# Altium schematic sheet [00] Block Diagram.SchDoc
size A4
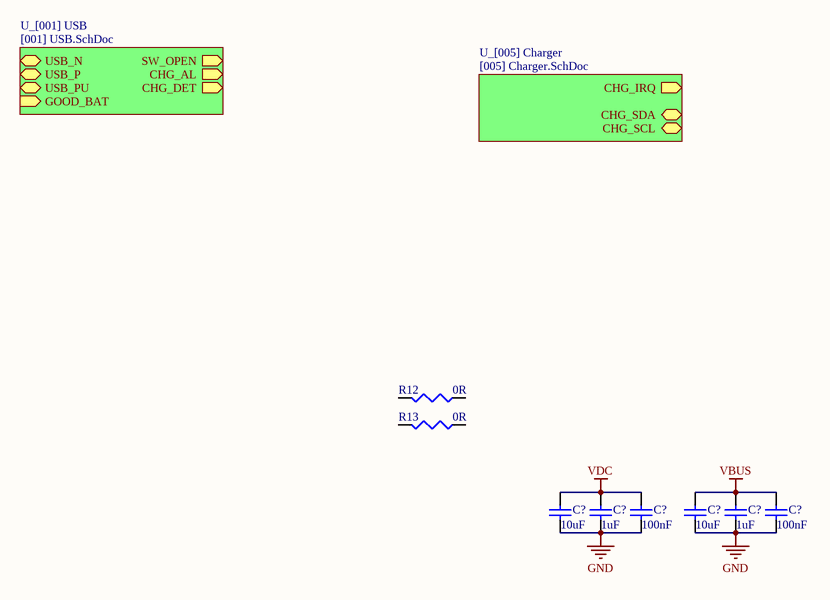
[diagram p0: [00] Block Diagram.SchDoc]

## Parts
(Parts that share a designator on the sheet are numbered #1, #2 ... from top to bottom, then left to right.)
C?#1  value 10uF  [1608[0603]]  (hidden comment: Cap Semi)
C?#2  value 1uF  [1608[0603]]  (hidden comment: Cap Semi)
C?#3  value 100nF  [1608[0603]]  (hidden comment: Cap Semi)
C?#4  value 10uF  [1608[0603]]  (hidden comment: Cap Semi)
C?#5  value 1uF  [1608[0603]]  (hidden comment: Cap Semi)
C?#6  value 100nF  [1608[0603]]  (hidden comment: Cap Semi)
R12  value 0R  [J1-0603]  (hidden comment: Res3)
R13  value 0R  [J1-0603]  (hidden comment: Res3)

## Sub-sheets
U_[001] USB = [001] USB.SchDoc: USB_N (bidir), USB_P (bidir), USB_PU (bidir), GOOD_BAT (in), SW_OPEN (out), CHG_AL (out), CHG_DET (out)
U_[005] Charger = [005] Charger.SchDoc: CHG_IRQ (out), CHG_SDA (bidir), CHG_SCL (bidir)

## Nets
GND: C?#1.1 C?#2.1 C?#3.1 C?#4.1 C?#5.1 C?#6.1
VBUS: C?#4.2 C?#5.2 C?#6.2
VDC: C?#1.2 C?#2.2 C?#3.2

Not connected (* = marked no-connect by the designer): R12 1 2; R13 1 2

## Library data of the parts
C?#1-C?#6 = Cap Semi: Capacitor (Semiconductor SIM Model); Published: 8-Jun-2000; LatestRevisionDate: 29-May-2009; LatestRevisionNote: IPC-7351 Footprint Added.; PackageReference: C1206; Publisher: Altium Limited; PackageDescription: Chip Capacitor
R12 R13 = Res3: Resistor; Published: 8-Jun-2000; LatestRevisionDate: 29-May-2009; LatestRevisionNote: IPC-7351 Footprint Added.; PackageReference: J1-0603; Publisher: Altium Limited; PackageDescription: Chip Resistor